# EAGLE design FRA_junctionB_v1 (EAGLE 9.6.2)
CNAME: FRA Junction Board; CREVISION: 02
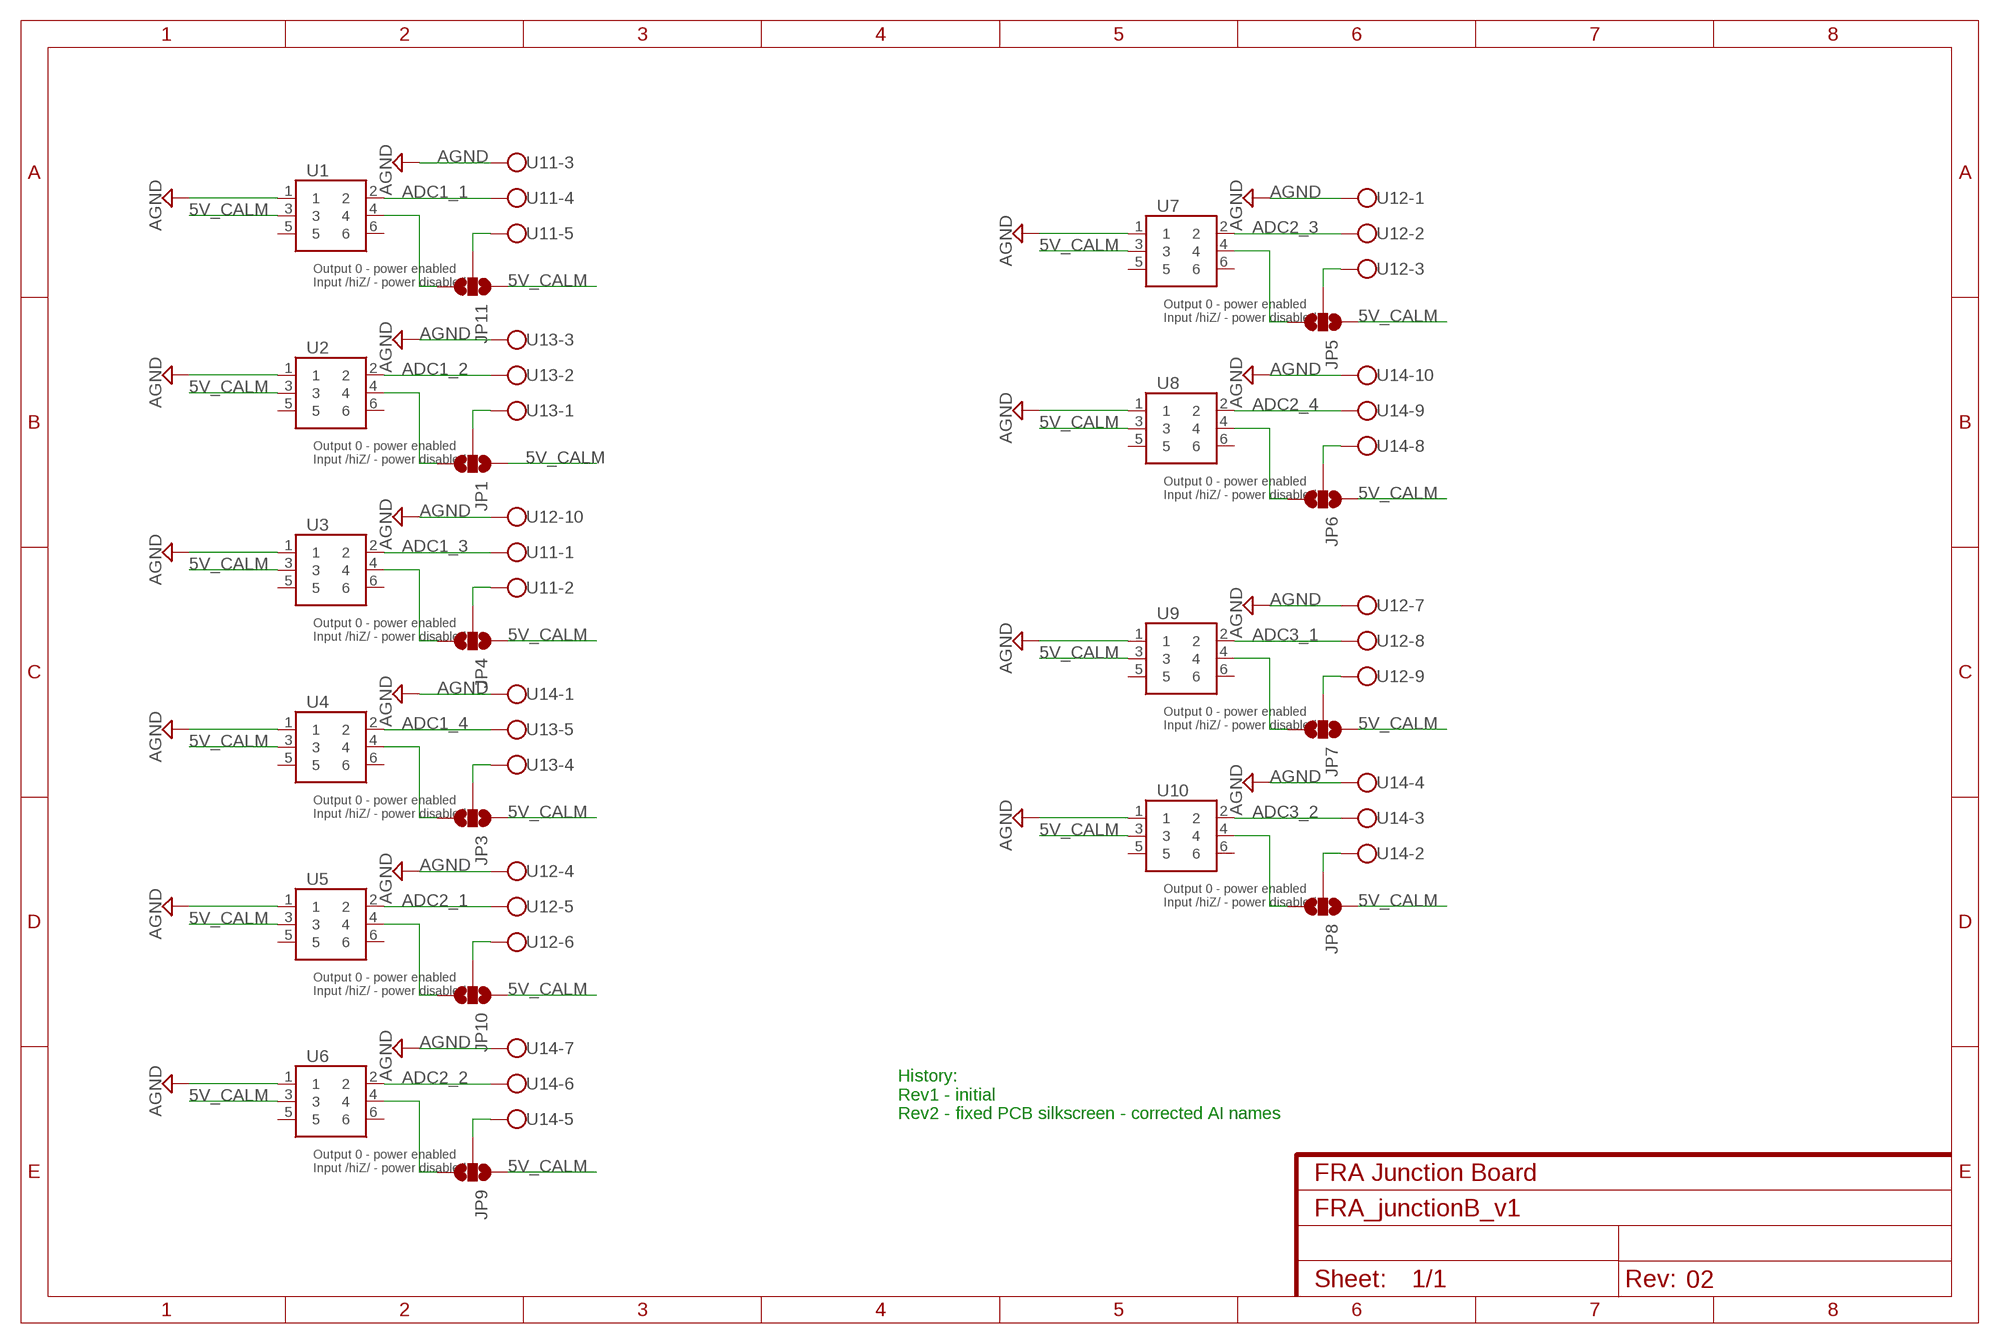
[diagram p0: schematic, sheet 1]

## Parts
JP1  JUMPER-SMT_3_NO_NO_SILK  [SMT-JUMPER_3_0-NO_TRACE_NO-SILK]
JP3  JUMPER-SMT_3_NO_NO_SILK  [SMT-JUMPER_3_0-NO_TRACE_NO-SILK]
JP4  JUMPER-SMT_3_NO_NO_SILK  [SMT-JUMPER_3_0-NO_TRACE_NO-SILK]
JP5  JUMPER-SMT_3_NO_NO_SILK  [SMT-JUMPER_3_0-NO_TRACE_NO-SILK]
JP6  JUMPER-SMT_3_NO_NO_SILK  [SMT-JUMPER_3_0-NO_TRACE_NO-SILK]
JP7  JUMPER-SMT_3_NO_NO_SILK  [SMT-JUMPER_3_0-NO_TRACE_NO-SILK]
JP8  JUMPER-SMT_3_NO_NO_SILK  [SMT-JUMPER_3_0-NO_TRACE_NO-SILK]
JP9  JUMPER-SMT_3_NO_NO_SILK  [SMT-JUMPER_3_0-NO_TRACE_NO-SILK]
JP10  JUMPER-SMT_3_NO_NO_SILK  [SMT-JUMPER_3_0-NO_TRACE_NO-SILK]
JP11  JUMPER-SMT_3_NO_NO_SILK  [SMT-JUMPER_3_0-NO_TRACE_NO-SILK]
U1  SSW-103-01-F-D  [SHDR6W79P254_2X3_813X495X851P]
U2  SSW-103-01-F-D  [SHDR6W79P254_2X3_813X495X851P]
U3  SSW-103-01-F-D  [SHDR6W79P254_2X3_813X495X851P]
U4  SSW-103-01-F-D  [SHDR6W79P254_2X3_813X495X851P]
U5  SSW-103-01-F-D  [SHDR6W79P254_2X3_813X495X851P]
U6  SSW-103-01-F-D  [SHDR6W79P254_2X3_813X495X851P]
U7  SSW-103-01-F-D  [SHDR6W79P254_2X3_813X495X851P]
U8  SSW-103-01-F-D  [SHDR6W79P254_2X3_813X495X851P]
U9  SSW-103-01-F-D  [SHDR6W79P254_2X3_813X495X851P]
U10  SSW-103-01-F-D  [SHDR6W79P254_2X3_813X495X851P]
U11  TB003V-500-P05BE  [TB003V-500-P05BE]
U12  TB003V-500-P10BE  [TB003V-500-P10BE]
U13  TB003V-500-P05BE  [TB003V-500-P05BE]
U14  TB003V-500-P10BE  [TB003V-500-P10BE]

## Nets
5V_CALM: JP1.1 JP3.1 JP4.1 JP5.1 JP6.1 JP7.1 JP8.1 JP9.1 JP10.1 JP11.1 U1.3 U2.3 U3.3 U4.3 U5.3 U6.3 U7.3 U8.3 U9.3 U10.3
ADC1_1: U1.2 U11.4
ADC1_2: U2.2 U13.2
ADC1_3: U3.2 U11.1
ADC1_4: U4.2 U13.5
ADC2_1: U5.2 U12.5
ADC2_2: U6.2 U14.6
ADC2_3: U7.2 U12.2
ADC2_4: U8.2 U14.9
ADC3_1: U9.2 U12.8
ADC3_2: U10.2 U14.3
AGND: U1.1 U2.1 U3.1 U4.1 U5.1 U6.1 U7.1 U8.1 U9.1 U10.1 U11.3 U12.1 U12.4 U12.7 U12.10 U13.3 U14.1 U14.4 U14.7 U14.10
N$1: JP1.2 U13.1
N$2: JP1.3 U2.4
N$3: JP3.2 U13.4
N$4: JP3.3 U4.4
N$5: JP4.2 U11.2
N$6: JP4.3 U3.4
N$7: JP5.2 U12.3
N$8: JP5.3 U7.4
N$9: JP6.2 U14.8
N$10: JP6.3 U8.4
N$11: JP7.2 U12.9
N$12: JP7.3 U9.4
N$13: JP8.2 U14.2
N$14: JP8.3 U10.4
N$15: JP9.2 U14.5
N$16: JP9.3 U6.4
N$17: JP10.2 U12.6
N$18: JP10.3 U5.4
N$19: JP11.2 U11.5
N$20: JP11.3 U1.4
Unconnected: U1.5 U1.6 U2.5 U2.6 U3.5 U3.6 U4.5 U4.6 U5.5 U5.6 U6.5 U6.6 U7.5 U7.6 U8.5 U8.6 U9.5 U9.6 U10.5 U10.6

## Notes on the sheet
- Output 0 - power enabled
  Input /hiZ/ - power disabled
- Output 0 - power enabled
  Input /hiZ/ - power disabled
- Output 0 - power enabled
  Input /hiZ/ - power disabled
- Output 0 - power enabled
  Input /hiZ/ - power disabled
- Output 0 - power enabled
  Input /hiZ/ - power disabled
- Output 0 - power enabled
  Input /hiZ/ - power disabled
- Output 0 - power enabled
  Input /hiZ/ - power disabled
- Output 0 - power enabled
  Input /hiZ/ - power disabled
- Output 0 - power enabled
  Input /hiZ/ - power disabled
- History:
  Rev1 - initial 
  Rev2 - fixed PCB silkscreen - corrected AI names
- Output 0 - power enabled
  Input /hiZ/ - power disabled

## Library data of the parts
JP1 JP3-JP11 = SparkFun-Jumpers:JUMPER-SMT_3_NO: Normally open jumper This jumper has three pads in close proximity to each other. Apply solder to close the connection(s).
U1-U10 = SamacSys_Parts:SSW-103-01-F-D: .100" Tiger Buy Socket Strip, 03 positions per row, D row Source: Datasheet <https://componentsearchengine.com/Datasheets/1/SSW-103-01-F-D.pdf>; DESCRIPTION: .100" Tiger Buy Socket Strip, 03 positions per row, D row; HEIGHT: 8.51mm; MANUFACTURER_NAME: SAMTEC; MANUFACTURER_PART_NUMBER: SSW-103-01-F-D; MOUSER_PART_NUMBER: 200-SSW10301FD; MOUSER_PRICE-STOCK: https://www.mouser.com/Search/Refine.aspx?Keyword=200-SSW10301FD; PARTNO: 61200621621
U11 U13 = SamacSys_Parts:TB003V-500-P05BE
U12 U14 = SamacSys_Parts:TB003V-500-P10BE

## Board
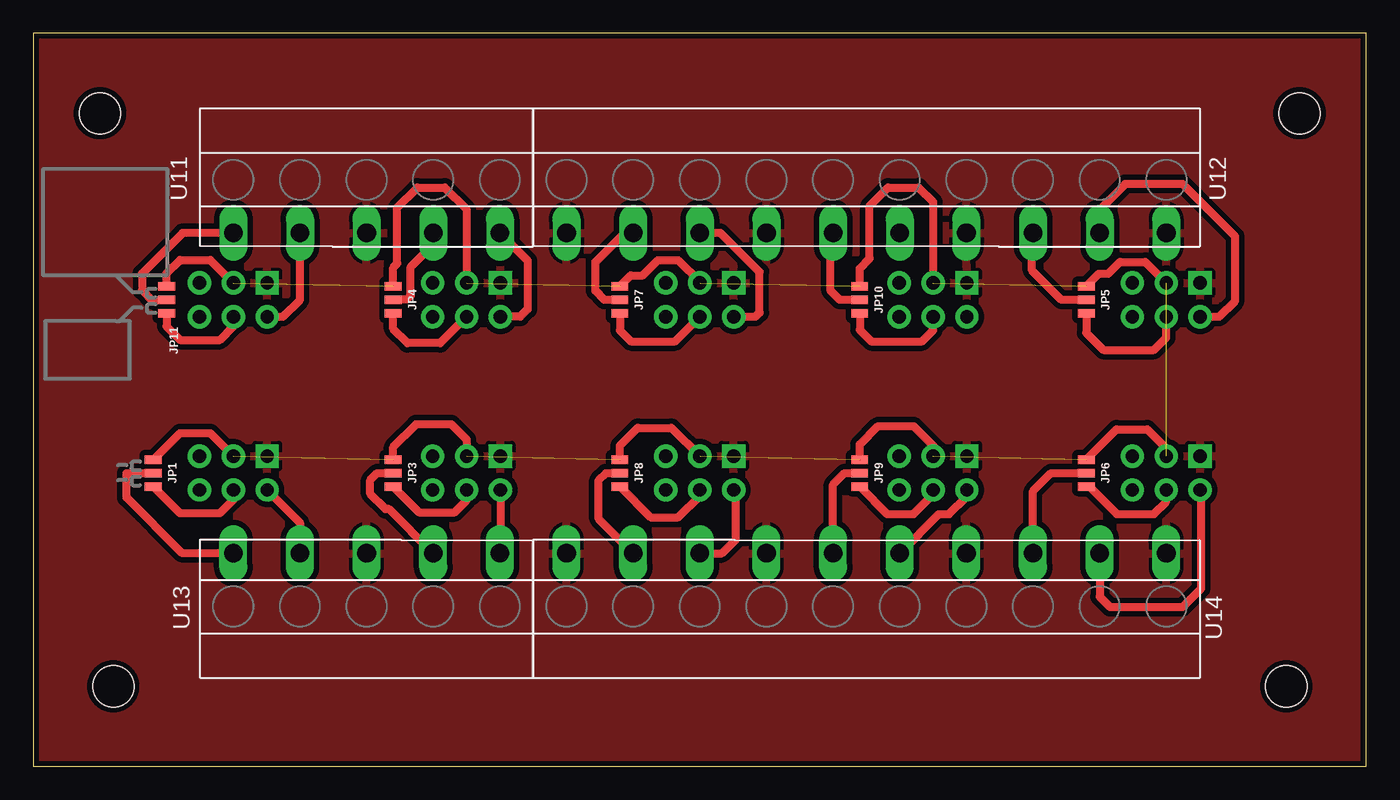
[diagram p1: board, top side]
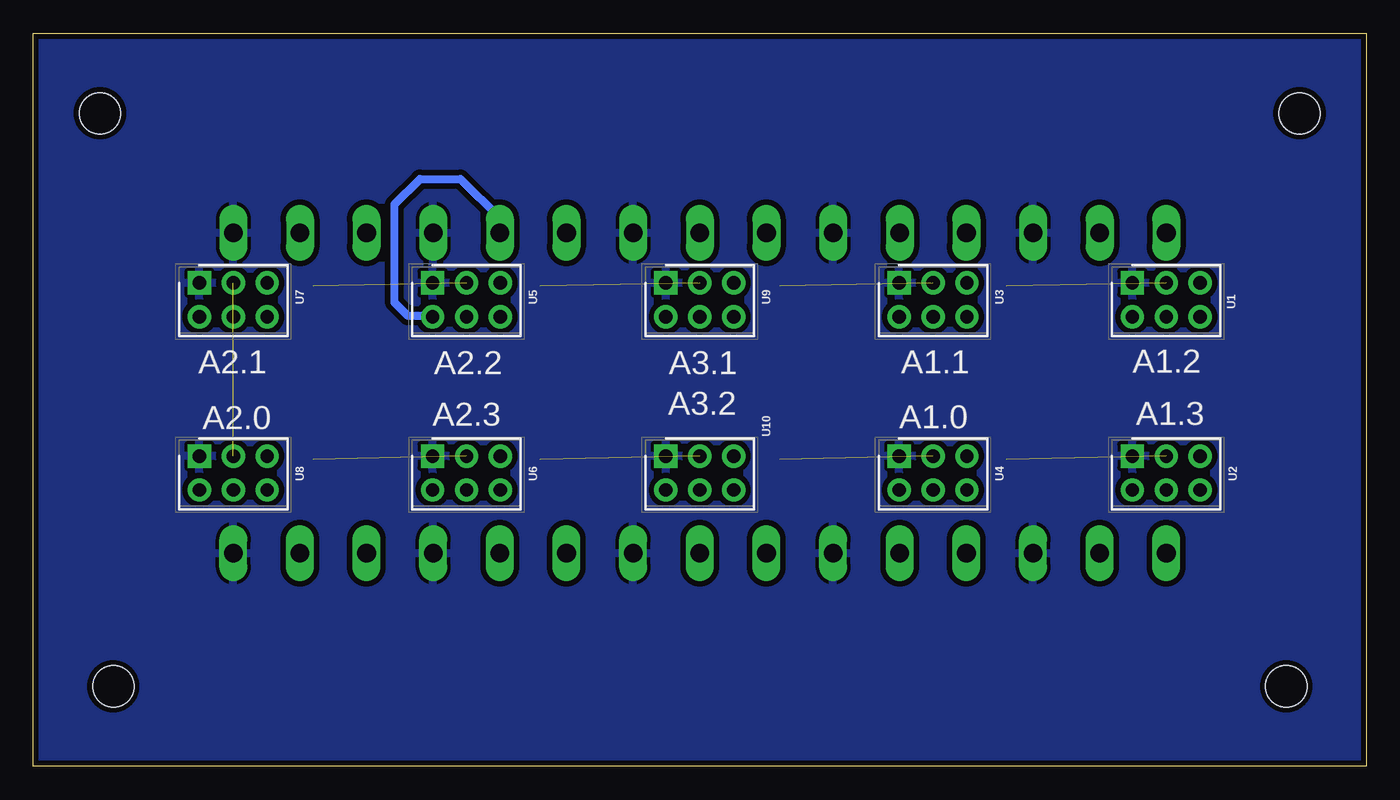
[diagram p2: board, bottom side, seen from below]

Size 100 x 55 mm. Coordinates in mm from the lower left corner, seen from the top.
Outline: 0,0 100,0 100,55 0,55 0,0
Copper layers (1*16): Top 0.035mm / dielectric 1.6mm / Bottom 0.035mm
Design rules "AllPCB": minimum track width 6mil, minimum drill 0.399mm, track to track 0.149859375mm, track to pad 0.149859375mm, pad to pad 8mil, via to via 17mil, smd to smd 6mil, copper to edge 10mil, drill to drill 24mil, minimum pad ring 10mil, minimum via ring 8mil, stop-mask expansion 4mil, vias tented up to drill 0.3mm, thermal gap 10mil
Holes 3.1 mm at 6,6 5,49 95,49 94,6
tKeepout: area 3.5,3.5 to 8.5,8.5; area 91.5,3.5 to 96.5,8.5; area 2.5,46.5 to 7.5,51.5; area 92.5,46.5 to 97.5,51.5

### Footprints (pad centres in the part's own frame; a part is rotated, then mirrored left to right if it is on the bottom)
SMT-JUMPER_3_0-NO_TRACE_NO-SILK = smd 0.635 x 1.27: 1 -1.016,0; 2 0,0; 3 1.016,0
SHDR6W79P254_2X3_813X495X851P = drill 1 pad 1.75 square: 1 -1.27,-2.54 | drill 1 pad 1.75: 2 1.27,-2.54; 3 -1.27,0; 4 1.27,0; 5 -1.27,2.54; 6 1.27,2.54
TB003V-500-P05BE = drill 1.4 long: 1 0,-0.02; 2 5,-0.02; 3 10,-0.02; 4 15,-0.02; 5 20,-0.02
TB003V-500-P10BE = drill 1.4 long: 1 0,-0.02; 2 5,-0.02; 3 10,-0.02; 4 15,-0.02; 5 20,-0.02; 6 25,-0.02; 7 30,-0.02; 8 35,-0.02; 9 40,-0.02; 10 45,-0.02

### Placement (x,y rotation side)
JP1  9,22 270 top
JP3  27,22 270 top
JP4  27,35 270 top
JP5  79,35 270 top
JP6  79,22 270 top
JP7  44,35 270 top
JP8  44,22 270 top
JP9  62,22 270 top
JP10  62,35 270 top
JP11  10,35 270 top
U1  15,35 270 bottom
U2  15,22 270 bottom
U3  32.5,35 270 bottom
U4  32.5,22 270 bottom
U5  67.5,35 270 bottom
U6  67.5,22 270 bottom
U7  85,35 270 bottom
U8  85,22 270 bottom
U9  50,35 270 bottom
U10  50,22 270 bottom
U11  35,40 180 top
U12  85,40 180 top
U13  15,16 0 top
U14  40,16 0 top

### Tracks (layer width: path | path; a pad name or v marks a point on that pad's centre or on a via)
5V_CALM  (9 unrouted)
  Top 0.61: JP1.1 9.02,23.02 11,25 13.27,25 U2.3 | JP11.1 10,37 11,38 13.27,38 U1.3 | JP4.1 27,37.41 27.3,37.72 27.3,41.91 28.83,43.43 30.86,43.43 32.5,41.8 U3.3 | JP7.1 44.81,36.83 45.72,36.83 46.86,37.97 48.39,37.97 50,36.36 U9.3 | JP10.1 62,37.36 62.74,38.1 62.74,42.04 64.14,43.43 66.42,43.43 67.5,42.35 U5.3 | JP5.1 79.94,36.96 80.64,36.96 81.53,37.85 83.42,37.85 U7.3 | JP3.1 27,23.95 28.7,25.65 31.37,25.65 32.51,24.51 32.51,23.28 U4.3 | JP8.1 44,24.06 45.34,25.4 47.87,25.4 U10.3 | JP9.1 62,24.15 63.37,25.53 66.04,25.53 67.56,24 67.56,23.33 U6.3 | JP6.1 81.26,25.27 83.57,25.27 85,23.84 U8.3
ADC1_1
  Top 0.61: U1.2 18.73,33.73 20,35 U11.4
ADC1_2
  Top 0.61: U2.2 20,18.27 U13.2
ADC1_3
  Top 0.61: U11.1 37.08,37.94 37.08,34.29 36.52,33.73 U3.2
ADC1_4
  Top 0.61: U4.2 35.04,16.02 U13.5
ADC2_1
  Bottom 0.61: U5.2 70.09,33.78 71.88,33.78 72.9,34.8 72.9,42.16 70.99,44.07 67.94,44.07 65,41.12 U12.5
ADC2_2
  Top 0.61: U14.6 67.94,18.92 68.71,18.92 70.04,20.26 U6.2
ADC2_3
  Top 0.61: U7.2 88.97,33.73 90.17,34.92 90.17,39.75 86.23,43.69 81.92,43.69 80,41.77 U12.2
ADC2_4
  Top 0.61: U14.9 80,12.71 80.77,11.94 86.23,11.94 87.63,13.34 87.63,20.64 U8.2
ADC3_1
  Top 0.61: U9.2 54.18,33.73 54.48,34.04 54.48,37.08 51.55,40.02 U12.8
ADC3_2
  Top 0.61: U14.3 51.67,15.98 52.7,17.02 52.7,20.57 U10.2
AGND
  pour Top (isolate 0.406): -4.95,60.07 110.49,60.07 110.74,59.82 110.74,-3.05 109.86,-3.94 -3.68,-3.94 -3.81,-4.06 -3.81,58.93
  pour Bottom (isolate 0.406): -5.84,61.98 101.85,61.98 105.92,57.91 105.92,-2.29 102.36,-5.84 -1.02,-5.84 -6.22,-0.64 -6.22,61.59
N$1
  Top 0.61: U13.1 11.18,15.98 7,20.16 7,22 JP1.2
N$2
  Top 0.61: JP1.3 10.98,19 14,19 15,20 U2.4
N$3
  Top 0.61: U13.4 26.68,19.3 26.42,19.3 25.27,20.45 25.27,21.46 25.81,22 JP3.2
N$4
  Top 0.61: JP3.3 28.93,19.05 31.62,19.05 32.5,19.93 U4.4
N$5
  Top 0.61: JP4.2 27.05,35.05 28.07,35.05 28.32,35.31 28.32,37.47 30,39.14 U11.2
N$6
  Top 0.61: U3.4 30.52,31.75 28.07,31.75 27,32.82 JP4.3
N$7
  Top 0.61: JP5.2 77.14,35 74.93,37.21 74.93,39.95 U12.3
N$8
  Top 0.61: JP5.3 79,32.52 78.99,32.51 80.26,31.24 84.07,31.24 85,32.17 U7.4
N$9
  Top 0.61: U14.8 75,20.64 76.36,22 JP6.2
N$10
  Top 0.61: JP6.3 79.22,20.98 81.28,18.92 84.07,18.92 85,19.85 U8.4
N$11
  Top 0.61: JP7.2 42.85,35 42.16,35.69 42.16,37.85 44.34,40.02 U12.9
N$12
  Top 0.61: JP7.3 44,32.71 44.83,31.88 48.15,31.88 U9.4
N$13
  Top 0.61: U14.2 42.42,18.56 42.42,21.46 42.95,22 JP8.2
N$14
  Top 0.61: JP8.3 46.31,18.67 48.39,18.67 50,20.28 U10.4
N$15
  Top 0.61: U14.5 60,21.14 60.86,22 JP9.2
N$16
  Top 0.61: JP9.3 64.06,18.92 66.04,18.92 67.5,20.38 U6.4
N$17
  Top 0.61: JP10.2 60.5,35 59.82,35.69 59.82,39.84 U12.6
N$18
  Top 0.61: JP10.3 62,32.74 62.87,31.88 66.67,31.88 67.5,32.7 U5.4
N$19
  Top 0.61: U11.5 11.2,40.02 8.16,36.98 8.16,35.73 8.89,35 JP11.2
N$20
  Top 0.61: JP11.3 10,33 11,32 14,32 15,33 U1.4

### Text on the board
bNames: A1.2 | A1.1 | A3.1 | A2.2 | A2.1 | A1.3 | A3.2 | A2.3 | A1.0 | A2.0
tDocu: 5V / --- / A1.2 / --- / GND / --- / 5V / --- / A1.1 / --- / GND / --- / 5V / / A3.1 / --- / GND / --- / 5V / --- / A2.2 / --- / GND / --- / 5V / --- / A2.1 / --- / GND | 5V,100mA / total / low / noise | 5V,2A / total | FRA Sensor unit junction board | Electronics design solutions s.r.o. | J. Repcik 12/2020 | Power / Select | 100mA / 2A | 5V / --- / A1.3 / --- / GND / --- / 5V / --- / A1.0 / --- / GND / --- / 5V / / A3.2 / --- / GND / --- / 5V / --- / A2.3 / --- / GND / --- / 5V / --- / A2.0 / --- / GND
bDocu: 5V | SDA_5V | GND | SCL_5V | AnalogIN | 5V/HiZ